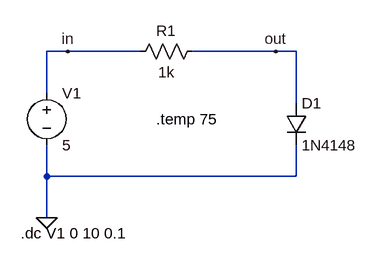
[diagram p0: schematic Diode_real_1N4148.asc]
Diode_real_1N4148.asc, the LTspice schematic file:
Version 4.1
SHEET 1 880 680
WIRE 96 64 64 64
WIRE 208 64 96 64
WIRE 416 64 288 64
WIRE 448 64 416 64
WIRE 64 128 64 64
WIRE 448 144 448 64
WIRE 64 256 64 208
WIRE 448 256 448 208
WIRE 448 256 64 256
WIRE 64 320 64 256
FLAG 64 320 0
FLAG 96 64 in
FLAG 416 64 out
SYMBOL voltage 64 112 R0
SYMATTR InstName V1
SYMATTR Value 5
SYMBOL diode 432 144 R0
SYMATTR InstName D1
SYMATTR Value 1N4148
SYMBOL res 304 48 R90
WINDOW 0 0 56 VBottom 2
WINDOW 3 32 56 VTop 2
SYMATTR InstName R1
SYMATTR Value 1k
TEXT 24 344 Left 2 !.dc V1 0 10 0.1
TEXT 232 168 Left 2 !.temp 75

The netlist it stands for:
* Diode_real_1N4148.asc
V1 in 0 5
D1 out 0 1N4148
R1 out in 1k
.model D D
.lib standard.dio
.dc V1 0 10 0.1
.temp 75
.backanno
.end

* Results of the author's LTspice run, read from the files saved beside the schematic
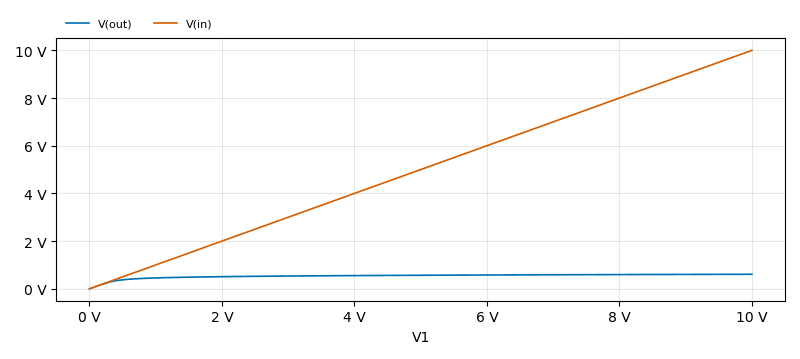
[diagram p1: DC transfer characteristic of Diode_real_1N4148.asc, plotted from the saved traces]
* DC transfer characteristic, 1 run:
*   V(out): 0 V at V1=0 V, 609.8 mV at V1=10 V, min 0 V, max 609.8 mV
*   V(in): 0 V at V1=0 V, 10 V at V1=10 V, min 0 V, max 10 V